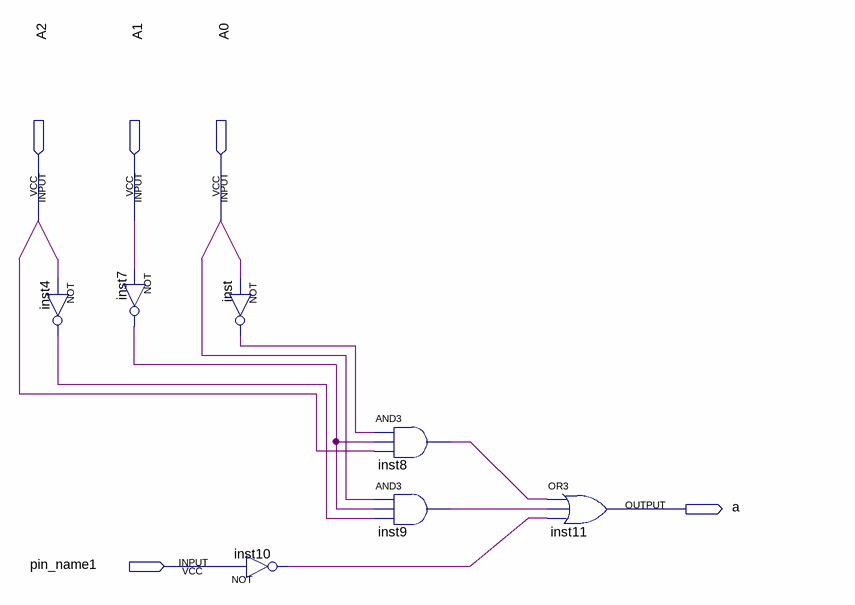
[diagram p0: schematic sheet]
// Quartus schematic segment_a.bdf as structural Verilog: 7 symbols, 5 pins
module segment_a (
  input  A2,
  input  A1,
  input  A0,
  input  pin_name1,
  output a
);

  wire inst4_out, inst7_out, inst8_out, inst9_out, inst10_out, inst_out;

  not inst4 (inst4_out, A2);
  not inst7 (inst7_out, A1);
  not inst (inst_out, A0);
  not inst10 (inst10_out, pin_name1);
  and inst8 (inst8_out, inst_out, inst7_out, A2);
  and inst9 (inst9_out, A0, inst7_out, inst4_out);
  or inst11 (a, inst8_out, inst9_out, inst10_out);
endmodule
